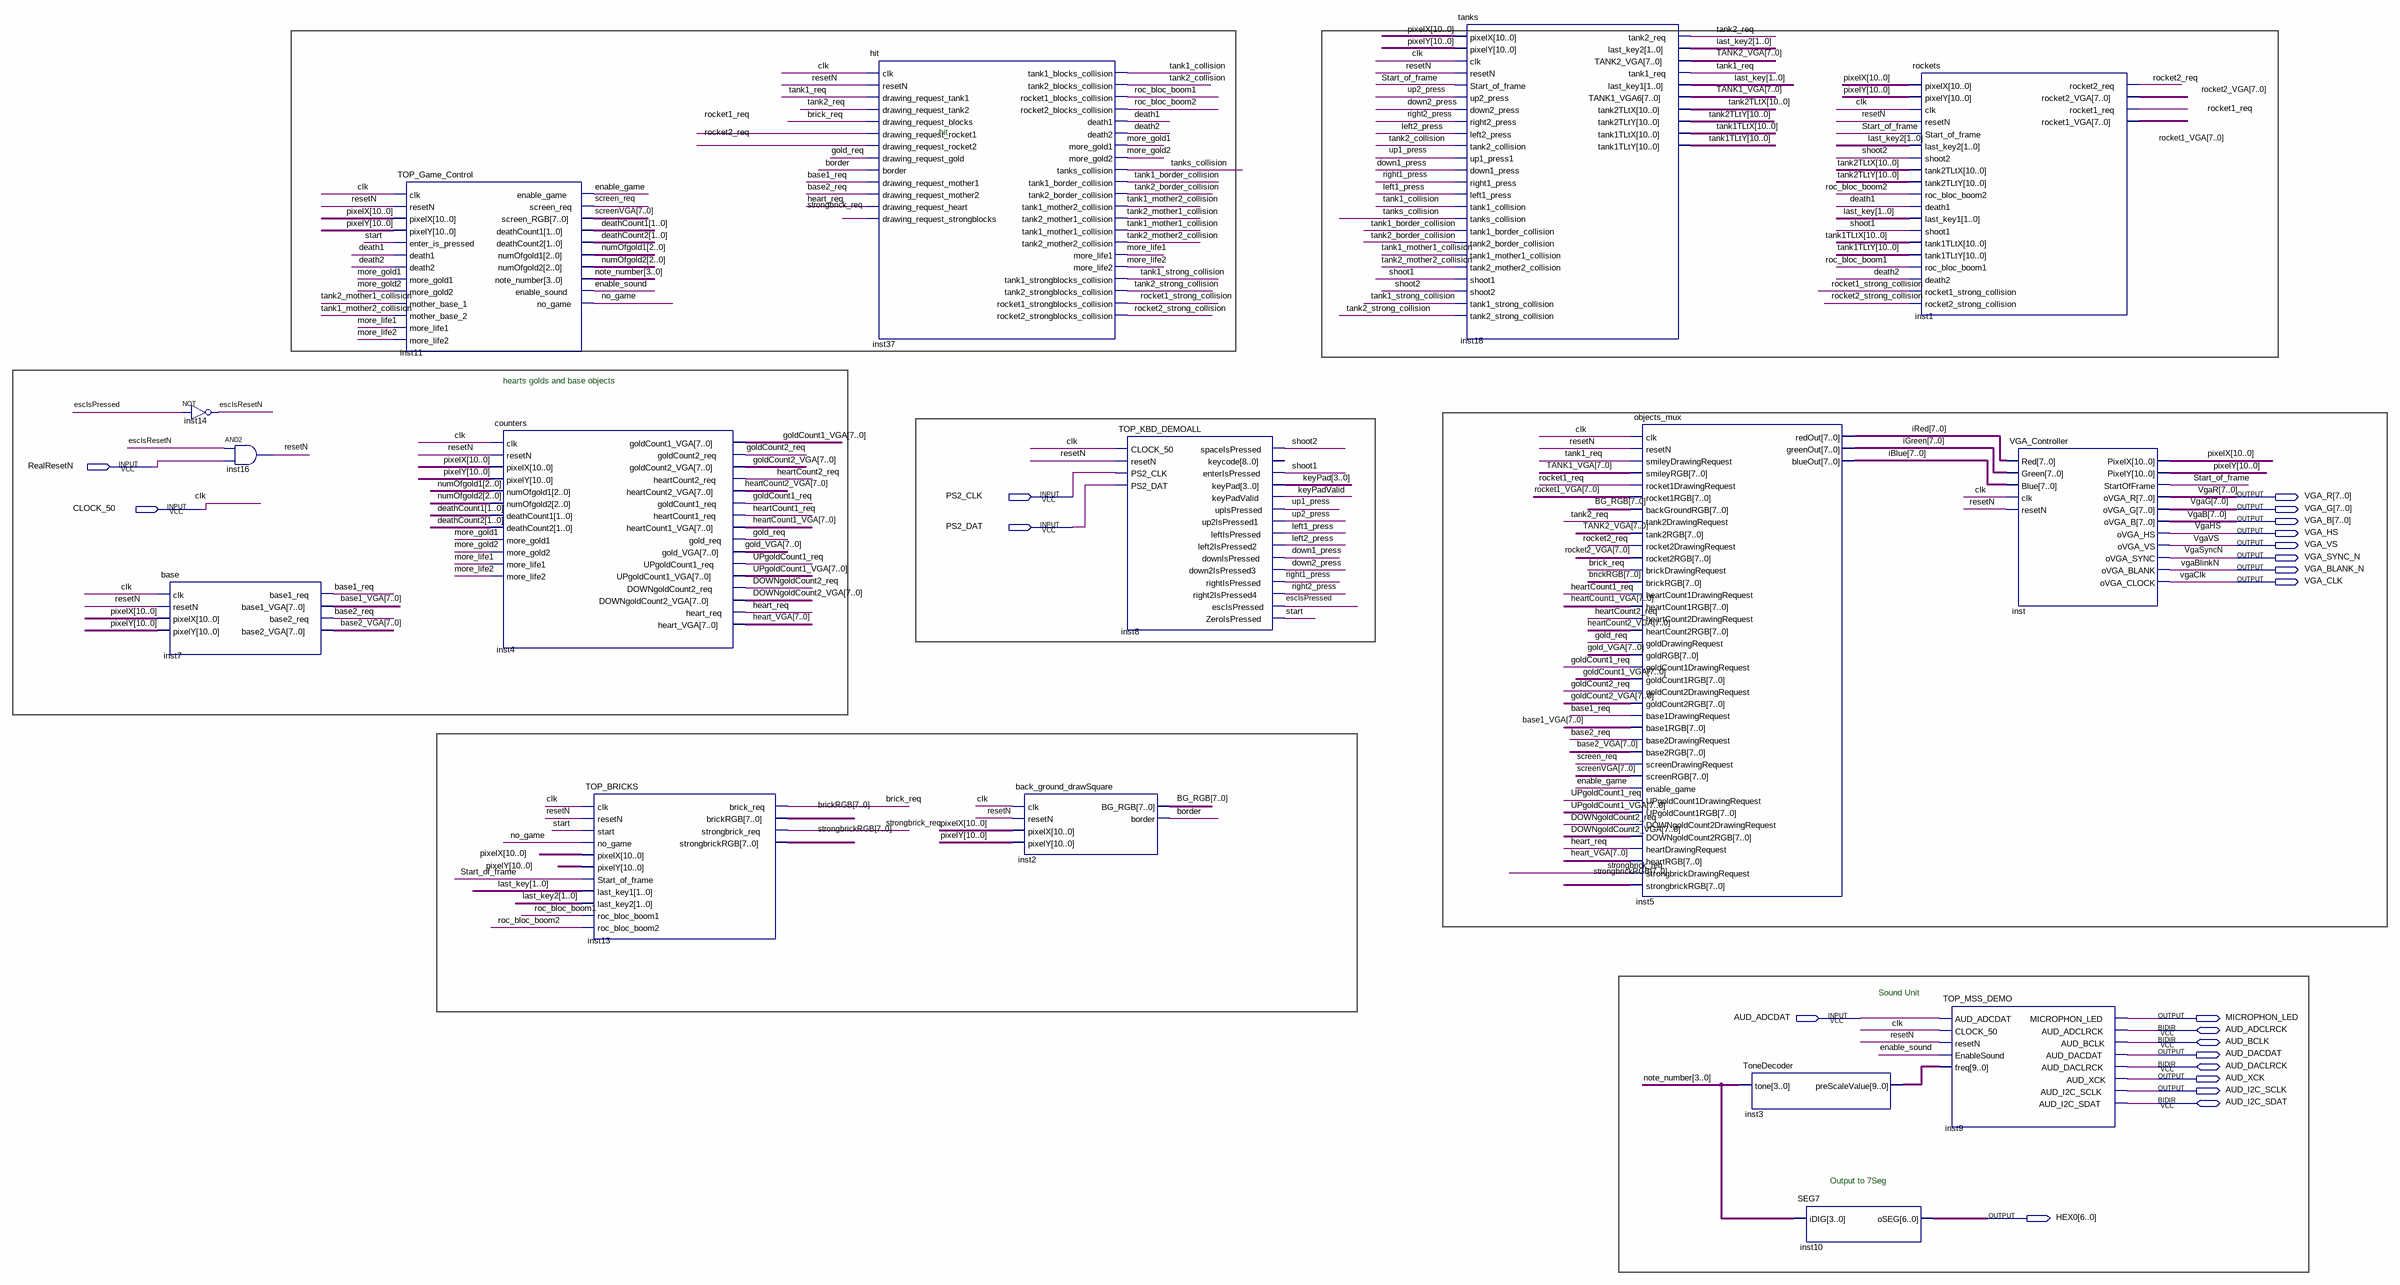
[diagram p0: schematic sheet]
// Quartus schematic TOP_VGA_DEMO_WITH_MSS_ALL.bdf as structural Verilog: 16 symbols, 22 pins
module TOP_VGA_DEMO_WITH_MSS_ALL (
  input  RealResetN,
  input  PS2_CLK,
  input  CLOCK_50,
  input  PS2_DAT,
  input  AUD_ADCDAT,
  inout  AUD_ADCLRCK,
  inout  AUD_BCLK,
  inout  AUD_DACLRCK,
  inout  AUD_I2C_SDAT,
  output [7:0] VGA_R,
  output [7:0] VGA_G,
  output [7:0] VGA_B,
  output VGA_HS,
  output VGA_VS,
  output VGA_SYNC_N,
  output VGA_BLANK_N,
  output VGA_CLK,
  output MICROPHON_LED,
  output AUD_DACDAT,
  output AUD_XCK,
  output AUD_I2C_SCLK,
  output [6:0] HEX0
);

  wire base1_req, base2_req, border, brick_req, death1, death2, down1_press, down2_press, DOWNgoldCount2_req,
       enable_game, enable_sound, escIsPressed, escIsResetN, gold_req, goldCount1_req, goldCount2_req,
       heart_req, heartCount1_req, heartCount2_req, keyPadValid, left1_press, left2_press, more_gold1,
       more_gold2, more_life1, more_life2, no_game, resetN, right1_press, right2_press, roc_bloc_boom1,
       roc_bloc_boom2, rocket1_req, rocket1_strong_collision, rocket2_req, rocket2_strong_collision,
       screen_req, shoot1, shoot2, start, Start_of_frame, strongbrick_req, tank1_border_collision,
       tank1_collision, tank1_mother1_collision, tank1_mother2_collision, tank1_req, tank1_strong_collision,
       tank2_border_collision, tank2_collision, tank2_mother1_collision, tank2_mother2_collision, tank2_req,
       tank2_strong_collision, tanks_collision, up1_press, up2_press, UPgoldCount1_req;
  wire [1:0] deathCount1, deathCount2, last_key, last_key2;
  wire [2:0] numOfgold1, numOfgold2;
  wire [3:0] keyPad, note_number;
  wire [7:0] base1_VGA, base2_VGA, BG_RGB, brickRGB, DOWNgoldCount2_VGA, gold_VGA, goldCount1_VGA,
       goldCount2_VGA, heart_VGA, heartCount1_VGA, heartCount2_VGA, iBlue, iGreen, iRed, rocket1_VGA,
       rocket2_VGA, screenVGA, strongbrickRGB, TANK1_VGA, TANK2_VGA, UPgoldCount1_VGA;
  wire [9:0] inst3_prescalevalue;
  wire [10:0] pixelX, pixelY, tank1TLtX, tank1TLtY, tank2TLtX, tank2TLtY;

  not inst14 (escIsResetN, escIsPressed);
  base inst7 (
    .clk(CLOCK_50), .resetN(resetN), .pixelX(pixelX), .pixelY(pixelY), .base1_req(base1_req),
    .base1_VGA(base1_VGA), .base2_req(base2_req), .base2_VGA(base2_VGA));
  and inst16 (resetN, escIsResetN, RealResetN);
  TOP_Game_Control inst11 (
    .clk(CLOCK_50), .resetN(resetN), .pixelX(pixelX), .pixelY(pixelY), .enter_is_pressed(start),
    .death1(death1), .death2(death2), .more_gold1(more_gold1), .more_gold2(more_gold2),
    .mother_base_1(tank2_mother1_collision), .mother_base_2(tank1_mother2_collision),
    .more_life1(more_life1), .more_life2(more_life2), .enable_game(enable_game), .screen_req(screen_req),
    .screen_RGB(screenVGA), .deathCount1(deathCount1), .deathCount2(deathCount2), .numOfgold1(numOfgold1),
    .numOfgold2(numOfgold2), .note_number(note_number), .enable_sound(enable_sound), .no_game(no_game));
  counters inst4 (
    .clk(CLOCK_50), .resetN(resetN), .pixelX(pixelX), .pixelY(pixelY), .numOfgold1(numOfgold1),
    .numOfgold2(numOfgold2), .deathCount1(deathCount1), .deathCount2(deathCount2), .more_gold1(more_gold1),
    .more_gold2(more_gold2), .more_life1(more_life1), .more_life2(more_life2),
    .goldCount1_VGA(goldCount1_VGA), .goldCount2_req(goldCount2_req), .goldCount2_VGA(goldCount2_VGA),
    .heartCount2_req(heartCount2_req), .heartCount2_VGA(heartCount2_VGA), .goldCount1_req(goldCount1_req),
    .heartCount1_req(heartCount1_req), .heartCount1_VGA(heartCount1_VGA), .gold_req(gold_req),
    .gold_VGA(gold_VGA), .UPgoldCount1_req(UPgoldCount1_req), .UPgoldCount1_VGA(UPgoldCount1_VGA),
    .DOWNgoldCount2_req(DOWNgoldCount2_req), .DOWNgoldCount2_VGA(DOWNgoldCount2_VGA), .heart_req(heart_req),
    .heart_VGA(heart_VGA));
  TOP_BRICKS inst13 (
    .clk(CLOCK_50), .resetN(resetN), .start(start), .no_game(no_game), .pixelX(pixelX), .pixelY(pixelY),
    .Start_of_frame(Start_of_frame), .last_key1(last_key), .last_key2(last_key2),
    .roc_bloc_boom1(roc_bloc_boom1), .roc_bloc_boom2(roc_bloc_boom2), .brick_req(brick_req),
    .brickRGB(brickRGB), .strongbrick_req(strongbrick_req), .strongbrickRGB(strongbrickRGB));
  hit inst37 (
    .clk(CLOCK_50), .resetN(resetN), .drawing_request_tank1(tank1_req), .drawing_request_tank2(tank2_req),
    .drawing_request_blocks(brick_req), .drawing_request_rocket1(rocket1_req),
    .drawing_request_rocket2(rocket2_req), .drawing_request_gold(gold_req), .border(border),
    .drawing_request_mother1(base1_req), .drawing_request_mother2(base2_req),
    .drawing_request_heart(heart_req), .drawing_request_strongblocks(strongbrick_req),
    .tank1_blocks_collision(tank1_collision), .tank2_blocks_collision(tank2_collision),
    .rocket1_blocks_collision(roc_bloc_boom1), .rocket2_blocks_collision(roc_bloc_boom2), .death1(death1),
    .death2(death2), .more_gold1(more_gold1), .more_gold2(more_gold2), .tanks_collision(tanks_collision),
    .tank1_border_collision(tank1_border_collision), .tank2_border_collision(tank2_border_collision),
    .tank1_mother2_collision(tank1_mother2_collision), .tank2_mother1_collision(tank2_mother1_collision),
    .tank1_mother1_collision(tank1_mother1_collision), .tank2_mother2_collision(tank2_mother2_collision),
    .more_life1(more_life1), .more_life2(more_life2), .tank1_strongblocks_collision(tank1_strong_collision),
    .tank2_strongblocks_collision(tank2_strong_collision),
    .rocket1_strongblocks_collision(rocket1_strong_collision),
    .rocket2_strongblocks_collision(rocket2_strong_collision));
  back_ground_drawSquare inst2 (
    .clk(CLOCK_50), .resetN(resetN), .pixelX(pixelX), .pixelY(pixelY), .BG_RGB(BG_RGB), .border(border));
  TOP_KBD_DEMOALL inst8 (
    .CLOCK_50(CLOCK_50), .resetN(resetN), .PS2_CLK(PS2_CLK), .PS2_DAT(PS2_DAT), .spaceIsPressed(shoot2),
    .enterIsPressed(shoot1), .keyPad(keyPad), .keyPadValid(keyPadValid), .upIsPressed(up1_press),
    .up2IsPressed1(up2_press), .leftIsPressed(left1_press), .left2IsPressed2(left2_press),
    .downIsPressed(down1_press), .down2IsPressed3(down2_press), .rightIsPressed(right1_press),
    .right2IsPressed4(right2_press), .escIsPressed(escIsPressed), .ZeroIsPressed(start));  // open: keycode
  tanks inst18 (
    .pixelX(pixelX), .pixelY(pixelY), .clk(CLOCK_50), .resetN(resetN), .Start_of_frame(Start_of_frame),
    .up2_press(up2_press), .down2_press(down2_press), .right2_press(right2_press), .left2_press(left2_press),
    .tank2_collision(tank2_collision), .up1_press1(up1_press), .down1_press(down1_press),
    .right1_press(right1_press), .left1_press(left1_press), .tank1_collision(tank1_collision),
    .tanks_collision(tanks_collision), .tank1_border_collision(tank1_border_collision),
    .tank2_border_collision(tank2_border_collision), .tank1_mother1_collision(tank1_mother1_collision),
    .tank2_mother2_collision(tank2_mother2_collision), .shoot1(shoot1), .shoot2(shoot2),
    .tank1_strong_collision(tank1_strong_collision), .tank2_strong_collision(tank2_strong_collision),
    .tank2_req(tank2_req), .last_key2(last_key2), .TANK2_VGA(TANK2_VGA), .tank1_req(tank1_req),
    .last_key1(last_key), .TANK1_VGA6(TANK1_VGA), .tank2TLtX(tank2TLtX), .tank2TLtY(tank2TLtY),
    .tank1TLtX(tank1TLtX), .tank1TLtY(tank1TLtY));
  objects_mux inst5 (
    .clk(CLOCK_50), .resetN(resetN), .smileyDrawingRequest(tank1_req), .smileyRGB(TANK1_VGA),
    .rocket1DrawingRequest(rocket1_req), .rocket1RGB(rocket1_VGA), .backGroundRGB(BG_RGB),
    .tank2DrawingRequest(tank2_req), .tank2RGB(TANK2_VGA), .rocket2DrawingRequest(rocket2_req),
    .rocket2RGB(rocket2_VGA), .brickDrawingRequest(brick_req), .brickRGB(brickRGB),
    .heartCount1DrawingRequest(heartCount1_req), .heartCount1RGB(heartCount1_VGA),
    .heartCount2DrawingRequest(heartCount2_req), .heartCount2RGB(heartCount2_VGA),
    .goldDrawingRequest(gold_req), .goldRGB(gold_VGA), .goldCount1DrawingRequest(goldCount1_req),
    .goldCount1RGB(goldCount1_VGA), .goldCount2DrawingRequest(goldCount2_req),
    .goldCount2RGB(goldCount2_VGA), .base1DrawingRequest(base1_req), .base1RGB(base1_VGA),
    .base2DrawingRequest(base2_req), .base2RGB(base2_VGA), .screenDrawingRequest(screen_req),
    .screenRGB(screenVGA), .enable_game(enable_game), .UPgoldCount1DrawingRequest(UPgoldCount1_req),
    .UPgoldCount1RGB(UPgoldCount1_VGA), .DOWNgoldCount2DrawingRequest(DOWNgoldCount2_req),
    .DOWNgoldCount2RGB(DOWNgoldCount2_VGA), .heartDrawingRequest(heart_req), .heartRGB(heart_VGA),
    .strongbrickDrawingRequest(strongbrick_req), .strongbrickRGB(strongbrickRGB), .redOut(iRed),
    .greenOut(iGreen), .blueOut(iBlue));
  ToneDecoder inst3 (.tone(note_number), .preScaleValue(inst3_prescalevalue));
  SEG7 inst10 (.iDIG(note_number), .oSEG(HEX0));
  rockets inst1 (
    .pixelX(pixelX), .pixelY(pixelY), .clk(CLOCK_50), .resetN(resetN), .Start_of_frame(Start_of_frame),
    .last_key2(last_key2), .shoot2(shoot2), .tank2TLtX(tank2TLtX), .tank2TLtY(tank2TLtY),
    .roc_bloc_boom2(roc_bloc_boom2), .death1(death1), .last_key1(last_key), .shoot1(shoot1),
    .tank1TLtX(tank1TLtX), .tank1TLtY(tank1TLtY), .roc_bloc_boom1(roc_bloc_boom1), .death2(death2),
    .rocket1_strong_collision(rocket1_strong_collision), .rocket2_strong_collision(rocket2_strong_collision),
    .rocket2_req(rocket2_req), .rocket2_VGA(rocket2_VGA), .rocket1_req(rocket1_req), .rocket1_VGA(rocket1_VGA));
  TOP_MSS_DEMO inst9 (
    .AUD_ADCDAT(AUD_ADCDAT), .CLOCK_50(CLOCK_50), .resetN(resetN), .EnableSound(enable_sound),
    .freq(inst3_prescalevalue), .MICROPHON_LED(MICROPHON_LED), .AUD_DACDAT(AUD_DACDAT), .AUD_XCK(AUD_XCK),
    .AUD_I2C_SCLK(AUD_I2C_SCLK), .AUD_ADCLRCK(AUD_ADCLRCK), .AUD_BCLK(AUD_BCLK), .AUD_DACLRCK(AUD_DACLRCK),
    .AUD_I2C_SDAT(AUD_I2C_SDAT));
  VGA_Controller inst (
    .Red(iRed), .Green(iGreen), .Blue(iBlue), .clk(CLOCK_50), .resetN(resetN), .PixelX(pixelX),
    .PixelY(pixelY), .StartOfFrame(Start_of_frame), .oVGA_R(VGA_R), .oVGA_G(VGA_G), .oVGA_B(VGA_B),
    .oVGA_HS(VGA_HS), .oVGA_VS(VGA_VS), .oVGA_SYNC(VGA_SYNC_N), .oVGA_BLANK(VGA_BLANK_N), .oVGA_CLOCK(VGA_CLK));

  // Other names for the same wires on the sheet: clk = CLOCK_50; VgaB[7:0] = VGA_B; vgaBlinkN = VGA_BLANK_N;
  //   vgaClk = VGA_CLK; VgaG[7:0] = VGA_G; VgaHS = VGA_HS; VgaR[7:0] = VGA_R; VgaSyncN = VGA_SYNC_N; VgaVS = VGA_VS

  // Notes on the sheet:
  //   hit
  //   hearts golds and base objects
  //   Sound Unit
  //   Output to 7Seg
endmodule
